# Altium schematic sheet MT-CHARHER  V1.0.0.SchDoc
size OrCAD D; SheetNumber: 0; SheetTotal: 0
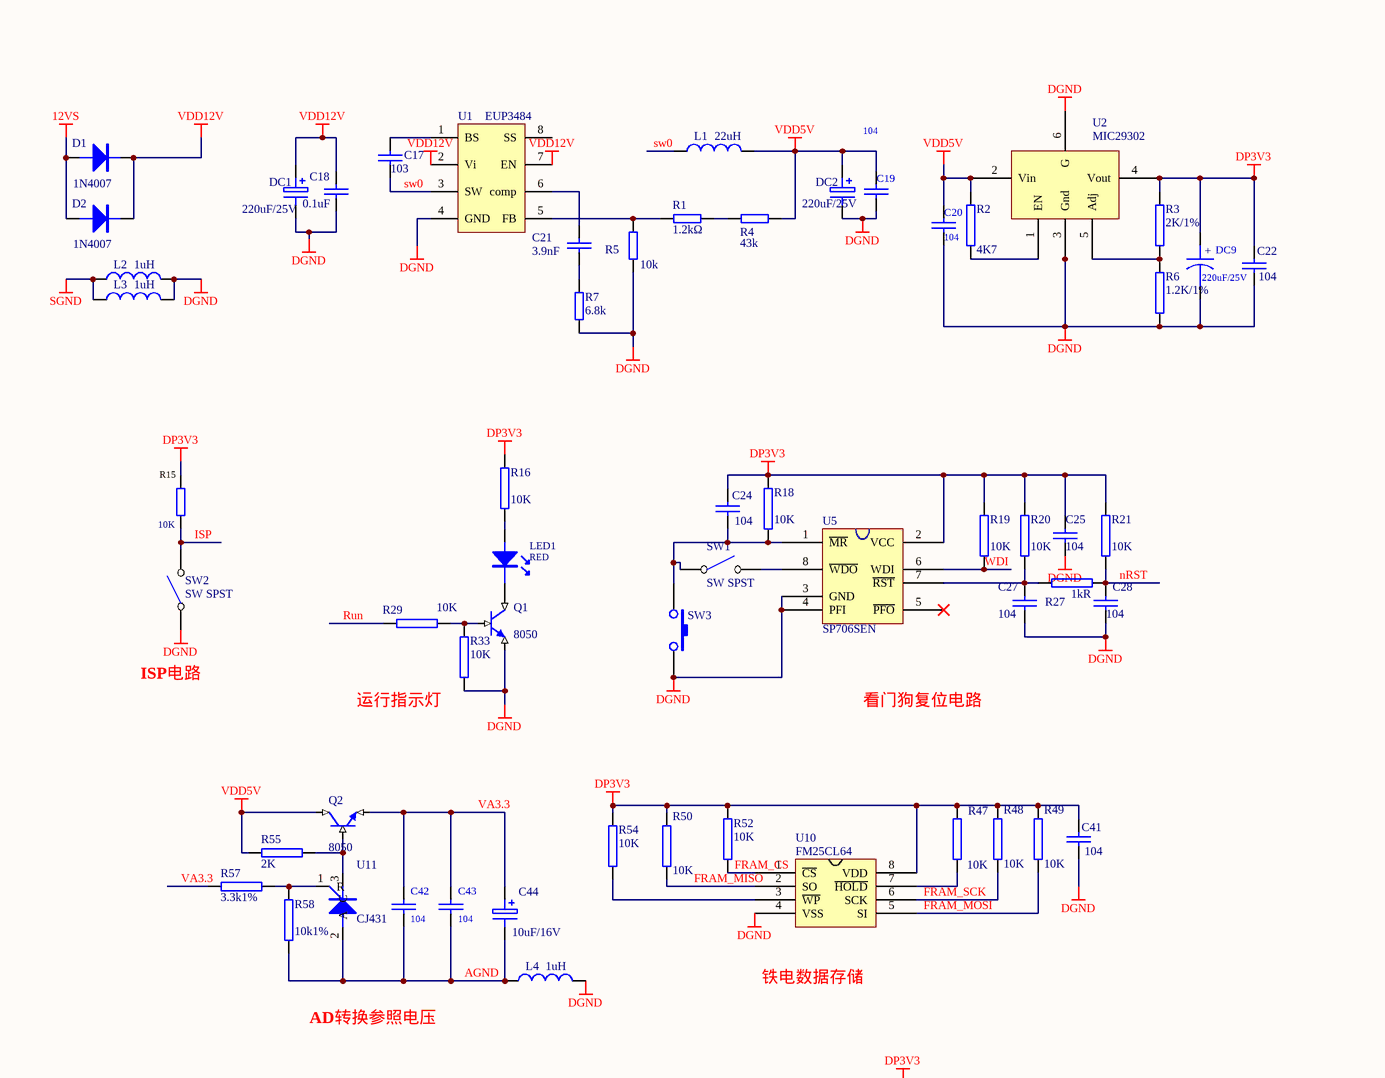
[diagram p0: MT-CHARHER  V1.0.0.SchDoc, top left]
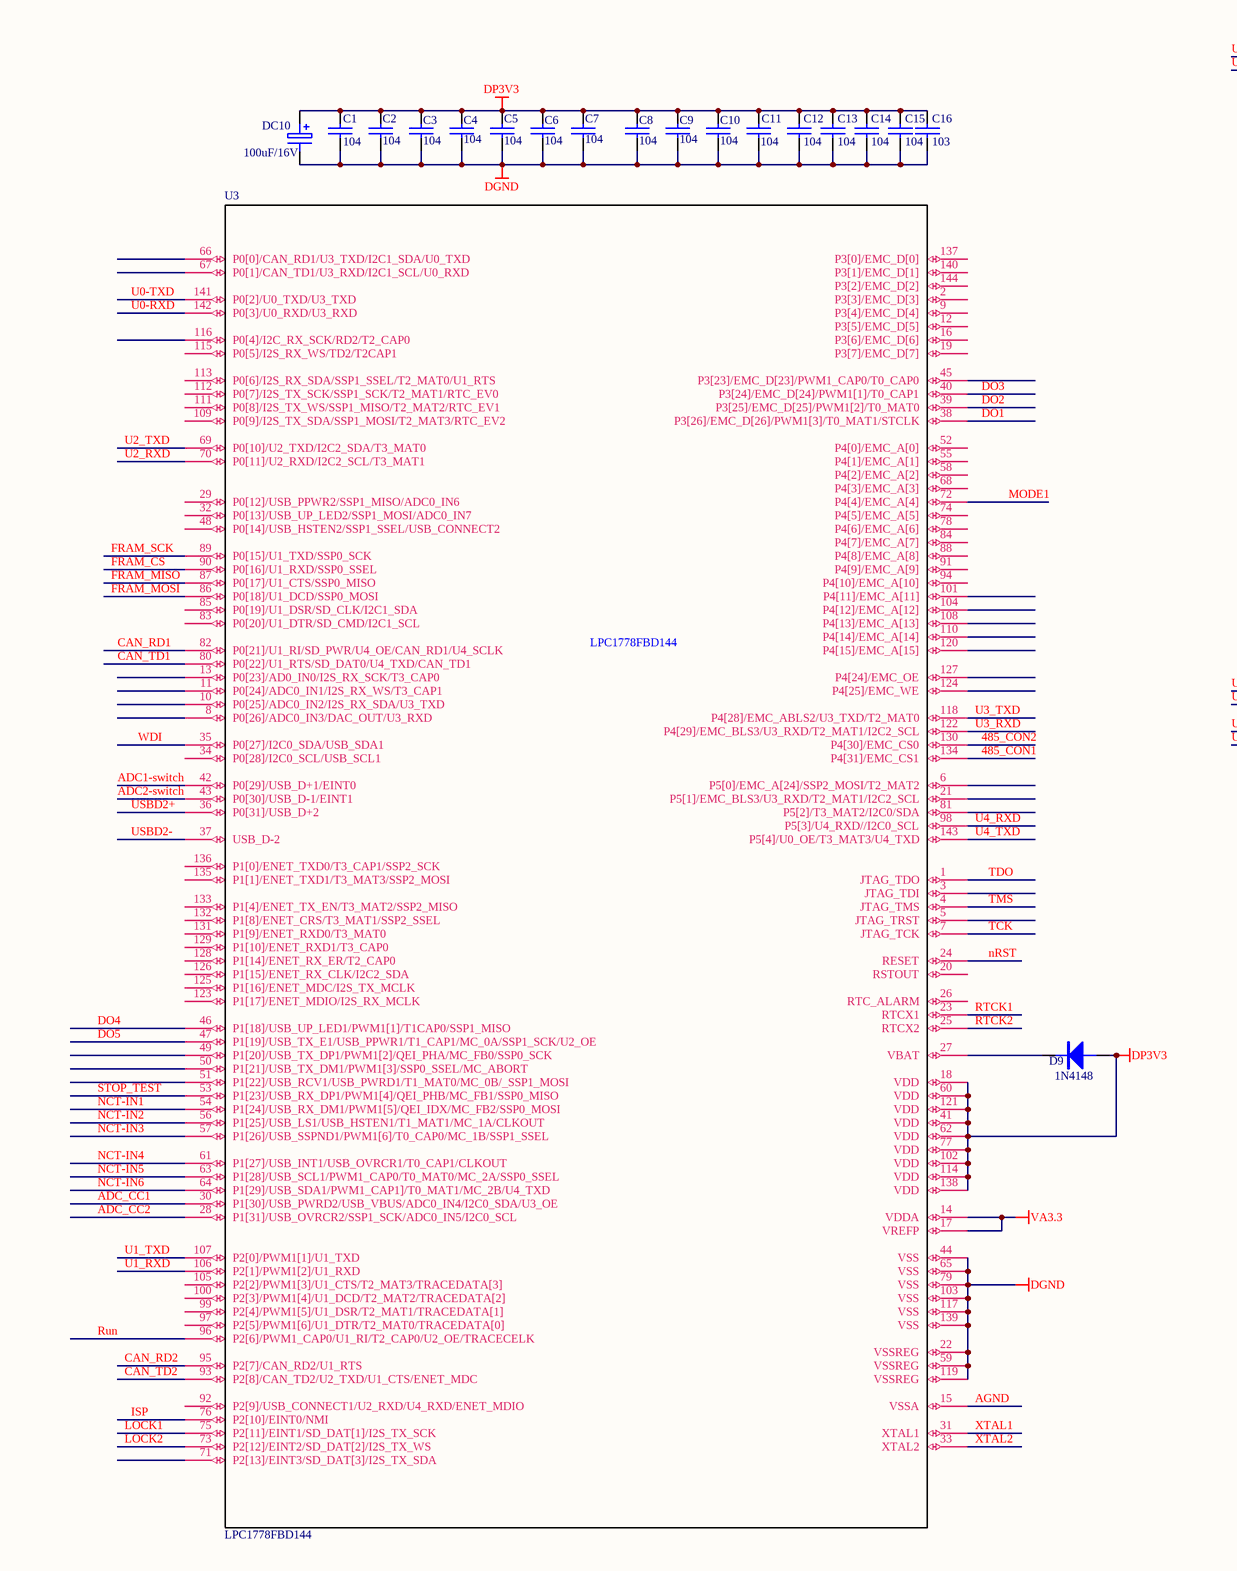
[diagram p1: MT-CHARHER  V1.0.0.SchDoc, top middle]
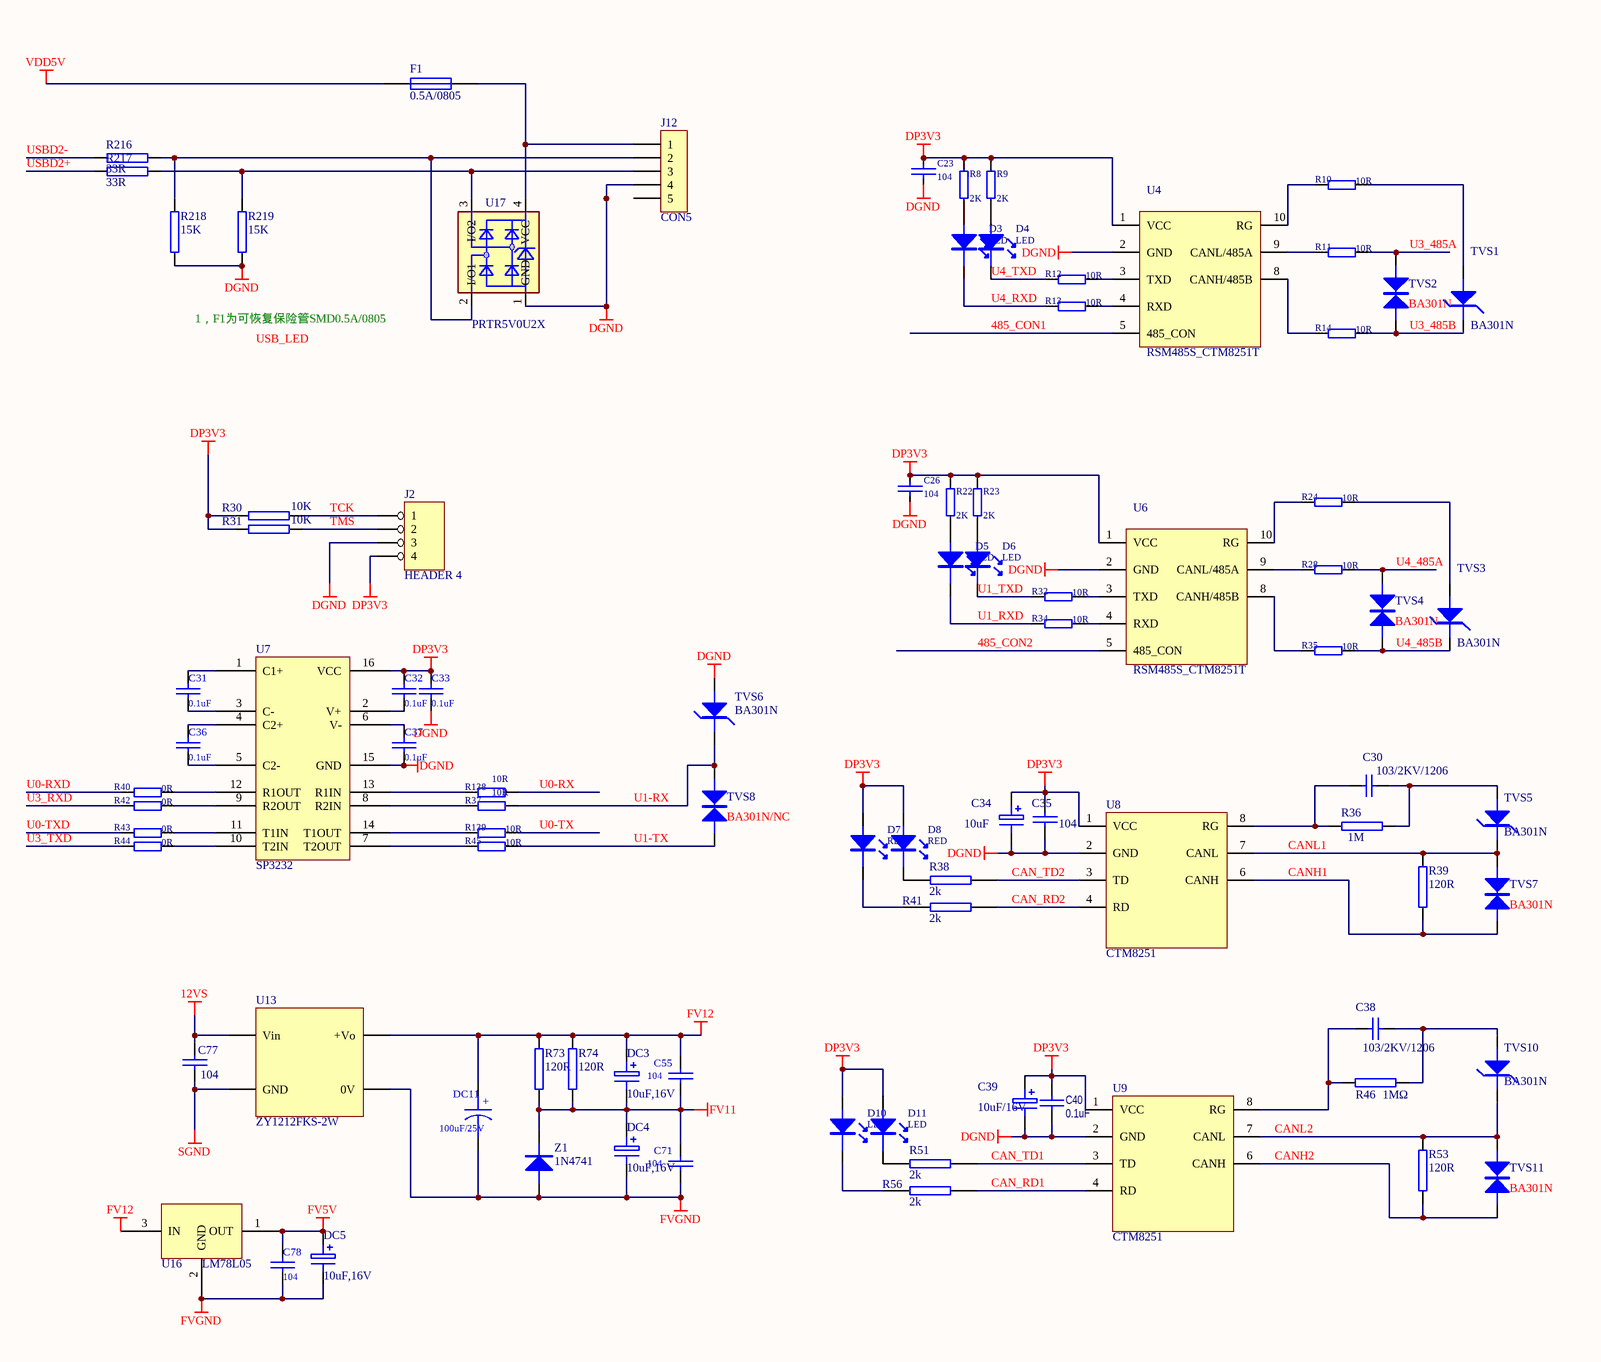
[diagram p2: MT-CHARHER  V1.0.0.SchDoc, top right]
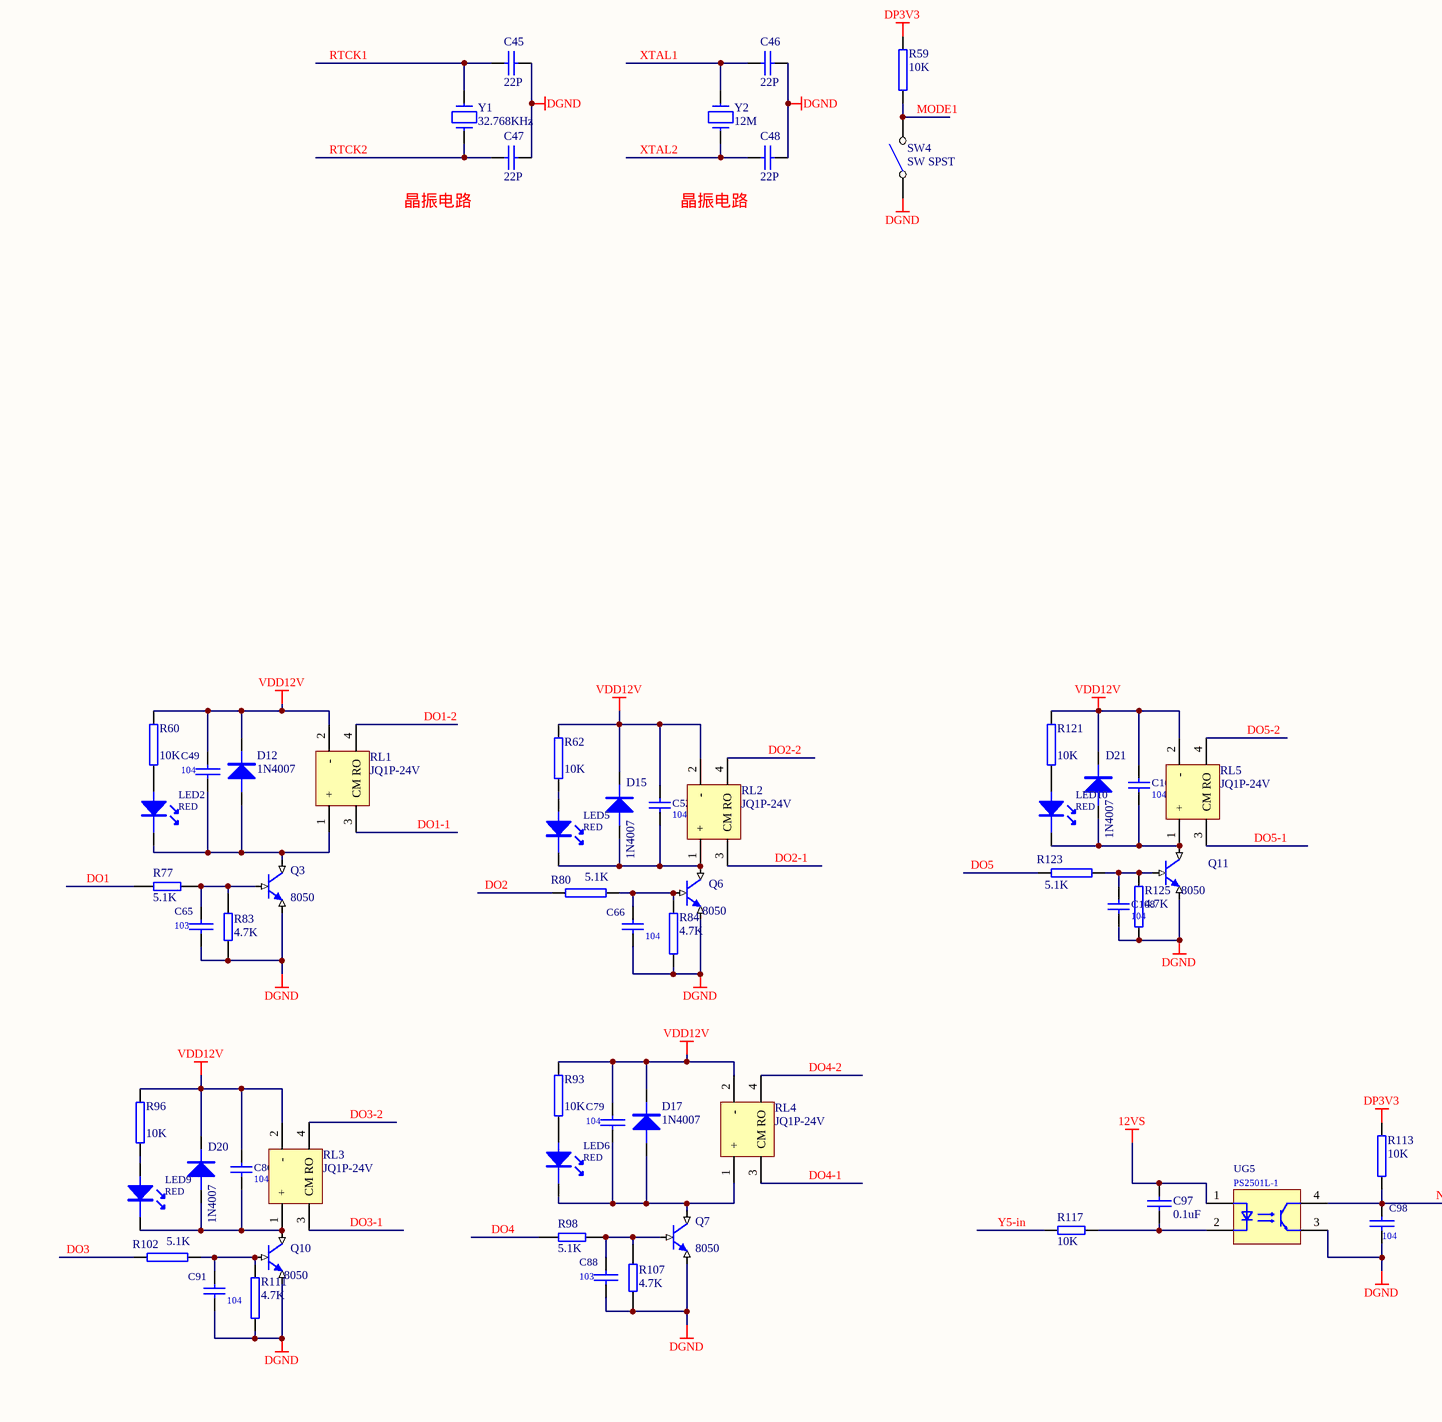
[diagram p3: MT-CHARHER  V1.0.0.SchDoc, bottom left]
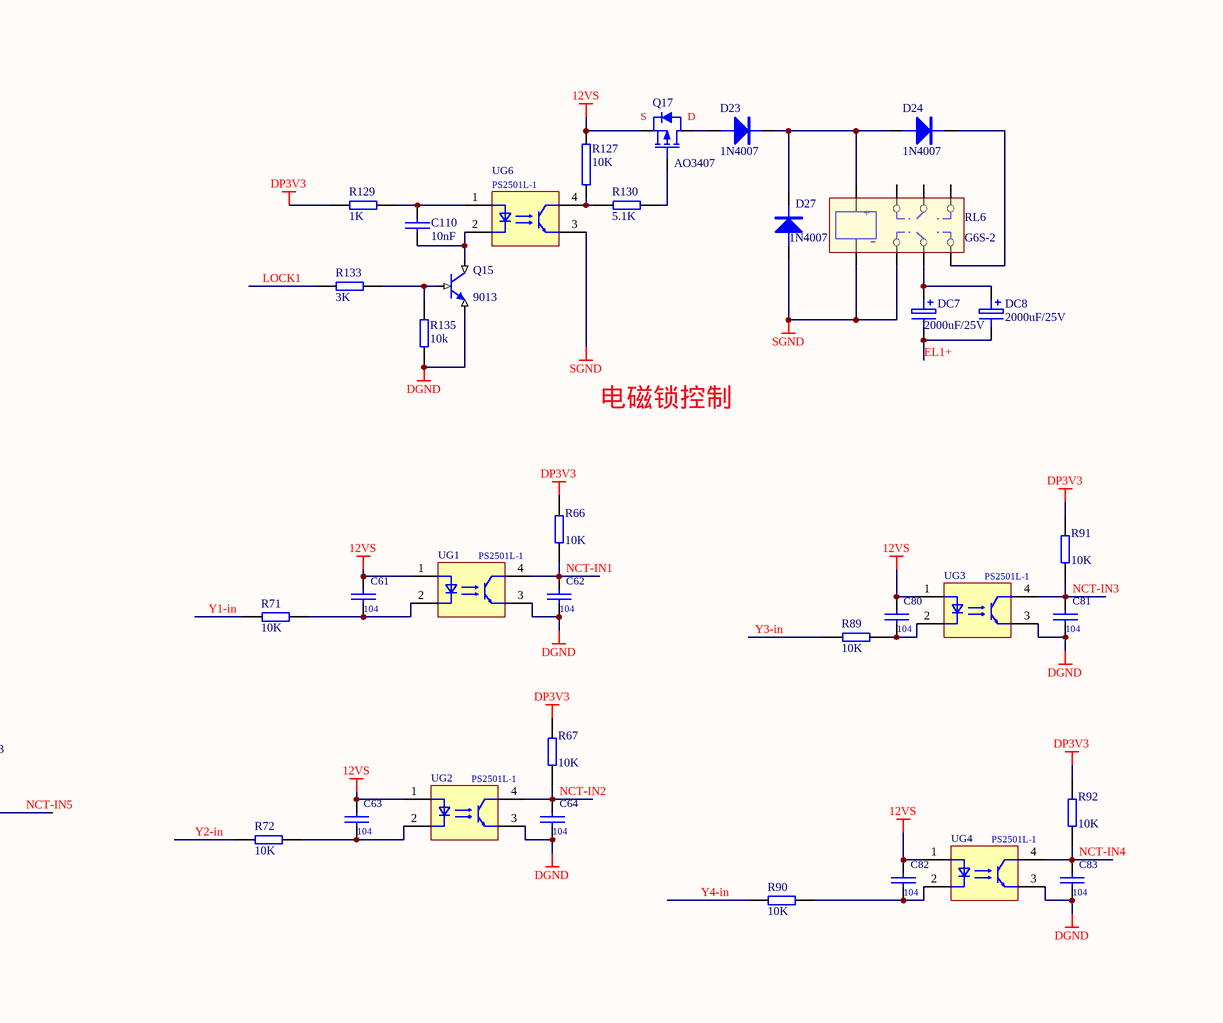
[diagram p4: MT-CHARHER  V1.0.0.SchDoc, bottom middle]
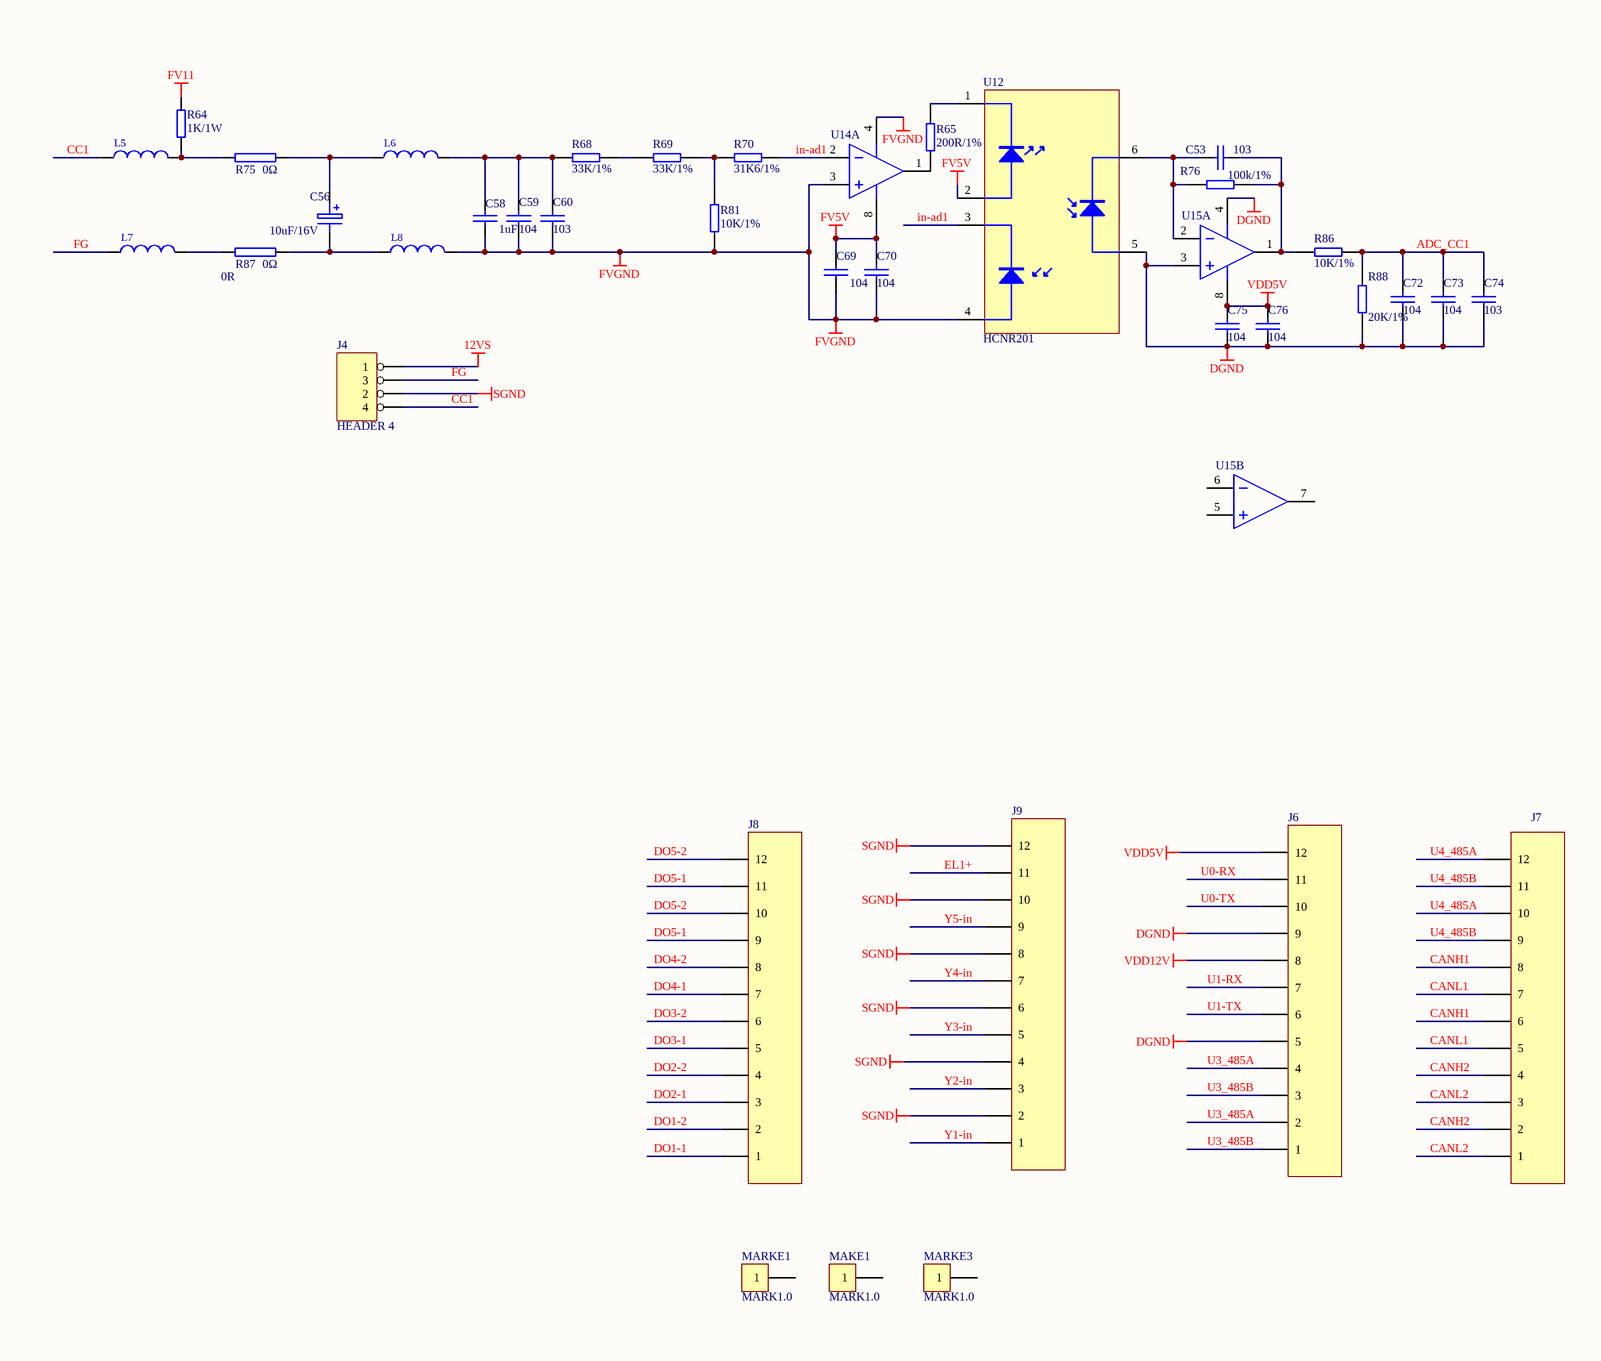
[diagram p5: MT-CHARHER  V1.0.0.SchDoc, bottom right]

## Parts
C1  104  [0603C]
C2  104  [0603C]
C3  104  [0603C]
C4  104  [0603C]
C5  104  [0603C]
C6  104  [0603C]
C7  104  [0603C]
C8  104  [0603C]
C9  104  [0603C]
C10  104  [0603C]
C11  104  [0603C]
C12  104  [0603C]
C13  104  [0603C]
C14  104  [0603C]
C15  104  [0603C]
C16  103  [0603C]
C17  103  [0603C]
C18  0.1uF  [0805C]
C19  104  [0603C]
C20  104  [0603C]
C21  3.9nF  [0603C]
C22  104  [0603C]
C23  104  [0603C]
C24  104  [0603C]
C25  104  [0603C]
C26  104  [0603C]
C27  104  [0603C]
C28  104  [0603C]
C30  103/2KV/1206  [1206C]
C31  0.1uF  [0603C]
C32  0.1uF  [0603C]
C33  0.1uF  [0603C]
C34  10uF  [CA1206]
C35  104  [0603C]
C36  0.1uF  [0603C]
C37  0.1uF  [0603C]
C38  103/2KV/1206  [1206C]
C39  10uF/16V  [CA1206]
C40  0.1uF  [0603C]
C41  104  [0603C]
C42  104  [0603C]
C43  104  [0603C]
C44  10uF/16V  [CA1206]
C45  22P  [0603C]
C46  22P  [0603C]
C47  22P  [0603C]
C48  22P  [0603C]
C49  104  [0603C]
C52  104  [0603C]
C53  103  [0603C]
C55  104  [0805C]
C56  10uF/16V  [CA1206]
C58  1uF  [0805C]
C59  104  [0603C]
C60  103  [0603C]
C61  104  [0603C]
C62  104  [0603C]
C63  104  [0603C]
C64  104  [0603C]
C65  103  [0603C]
C66  104  [0603C]
C69  104  [0603C]
C70  104  [0603C]
C71  104  [0805C]
C72  104  [0603C]
C73  104  [0603C]
C74  103  [0603C]
C75  104  [0603C]
C76  104  [0603C]
C77  104  [0805C]
C78  104  [0805C]
C79  104  [0603C]
C80  104  [0603C]
C81  104  [0603C]
C82  104  [0603C]
C83  104  [0603C]
C86  104  [0603C]
C88  103  [0603C]
C91  104  [0603C]
C97  0.1uF  [0603C]
C98  104  [0603C]
C106  104  [0603C]
C108  104  [0603C]
C110  10nF  [0603C]
D1  1N4007  [1206D]
D2  1N4007  [1206D]
D3  LED  [D0805]
D4  LED  [D0805]
D5  LED  [D0805]
D6  LED  [D0805]
D7  RED  [D0805]
D8  RED  [D0805]
D9  1N4148  [1206D]
D10  LED  [D0805]
D11  LED  [D0805]
D12  1N4007  [1206D]
D15  1N4007  [1206D]
D17  1N4007  [1206D]
D20  1N4007  [1206D]
D21  1N4007  [1206D]
D23  1N4007  [1206D]
D24  1N4007  [1206D]
D27  1N4007  [1206D]
DC1  220uF/25V  [C100UF16VEJ]
DC2  220uF/25V  [C100UF16VEJ]
DC3  10uF,16V  [CA1206]
DC4  10uF,16V  [CA1206]
DC5  10uF,16V  [CA1206]
DC7  2000uF/25V  [CAP12.5*20]
DC8  2000uF/25V  [CAP12.5*20]
DC9  220uF/25V  [C100UF16VEJ]
DC10  100uF/16V  [C100UF16VEJ]
DC11  100uF/25V  [C100UF16VEJ]
F1  0.5A/0805  [0805R]
J2  HEADER 4  [COM-2.54mm-90]
J4  HEADER 4  [KF2EDG-4P-3.81mm]
J6  J?  [KF2EDG-12P-3.81mm]  (value not drawn)
J7  J?  [KF2EDG-12P-3.81mm]  (value not drawn)
J8  J8  [KF2EDG-12P-3.81mm]  (value not drawn)
J9  J8  [KF2EDG-12P-3.81mm]  (value not drawn)
J12  CON5  [USB-A]
L1  22uH  [LC7*7*3_L]
L2  1uH  [1206R]
L3  1uH  [1206R]
L4  1uH  [1206R]
L5  1uH  [LC7*7*3_L]  (value not drawn)
L6  1uH  [1206R]  (value not drawn)
L7  1uH  [LC7*7*3_L]  (value not drawn)
L8  1uH  [1206R]  (value not drawn)
LED1  RED  [D0805]
LED2  RED  [D0805]
LED5  RED  [D0805]
LED6  RED  [D0805]
LED9  RED  [D0805]
LED10  RED  [D0805]
MAKE1  MARK1.0  [MARK1.0]
MARKE1  MARK1.0  [MARK1.0]
MARKE3  MARK1.0  [MARK1.0]
Q1  8050  [SOT23]
Q2  8050  [SOT23]
Q3  8050  [SOT23]
Q6  8050  [SOT23]
Q7  8050  [SOT23]
Q10  8050  [SOT23]
Q11  8050  [SOT23]
Q15  9013  [SOT23]
Q17  AO3407  [SOT-23L]
R1  1.2kΩ  [0603R]
R2  4K7  [0603R]
R3  2K/1%  [0603R]
R4  43k  [0603R]
R5  10k  [0603R]
R6  1.2K/1%  [0603R]
R7  6.8k  [0603R]
R8  2K  [0603R]
R9  2K  [0603R]
R10  10R  [0603R]
R11  10R  [0603R]
R12  10R  [0603R]
R13  10R  [0603R]
R14  10R  [0603R]
R15  10K  [0603R]
R16  10K  [0603R]
R18  10K  [0603R]
R19  10K  [0603R]
R20  10K  [0603R]
R21  10K  [0603R]
R22  2K  [0603R]
R23  2K  [0603R]
R24  10R  [0603R]
R27  1kR  [0603R]
R28  10R  [0603R]
R29  10K  [0603R]
R30  10K  [0603R]
R31  10K  [0603R]
R32  10R  [0603R]
R33  10K  [0603R]
R34  10R  [0603R]
R35  10R  [0603R]
R36  1M  [1206R]
R37  10R  [0603R]
R38  2k  [0603R]
R39  120R  [1206R]
R40  0R  [0603R]
R41  2k  [0603R]
R42  0R  [0603R]
R43  0R  [0603R]
R44  0R  [0603R]
R45  10R  [0603R]
R46  value 1MΩ  [1206R]  (hidden comment: 1M)
R47  10K  [0603R]
R48  10K  [0603R]
R49  10K  [0603R]
R50  10K  [0603R]
R51  2k  [0603R]
R52  10K  [0603R]
R53  120R  [1206R]
R54  10K  [0603R]
R55  2K  [0603R]
R56  2k  [0603R]
R57  3.3k1%  [0603R]
R58  10k1%  [0603R]
R59  10K  [0603R]
R60  10K  [0603R]
R62  10K  [0603R]
R64  1K/1W  [R1-1]
R65  200R/1%  [0603R]
R66  10K  [0603R]
R67  10K  [0603R]
R68  33K/1%  [0603R]
R69  33K/1%  [0603R]
R70  31K6/1%  [0603R]
R71  10K  [0603R]
R72  10K  [0603R]
R73  120R  [1206R]
R74  120R  [1206R]
R75  value 0Ω  [1206R]
R76  100k/1%  [0603R]
R77  5.1K  [0603R]
R80  5.1K  [0603R]
R81  10K/1%  [0603R]
R83  4.7K  [0603R]
R84  4.7K  [0603R]
R86  10K/1%  [0603R]
R87  0R  value 0Ω  [1206R]
R88  20K/1%  [0603R]
R89  10K  [0603R]
R90  10K  [0603R]
R91  10K  [0603R]
R92  10K  [0603R]
R93  10K  [0603R]
R96  10K  [0603R]
R98  5.1K  [0603R]
R102  5.1K  [0603R]
R107  4.7K  [0603R]
R111  4.7K  [0603R]
R113  10K  [0603R]
R117  10K  [0603R]
R121  10K  [0603R]
R123  5.1K  [0603R]
R125  4.7K  [0603R]
R127  10K  [0603R]
R129  1K  [0603R]
R130  5.1K  [0603R]
R133  3K  [0603R]
R135  10k  [0603R]
R138  10R  [0603R]
R139  10R  [0603R]
R216  33R  [0603R]
R217  33R  [0603R]
R218  15K  [0603R]
R219  15K  [0603R]
RL1  JQ1P-24V  [HF32F-12V]
RL2  JQ1P-24V  [HF32F-12V]
RL3  JQ1P-24V  [HF32F-12V]
RL4  JQ1P-24V  [HF32F-12V]
RL5  JQ1P-24V  [HF32F-12V]
RL6  G6S-2  [G6S-2]
SW1  SW SPST  [SW1]
SW2  SW SPST  [SW1]
SW3  按键  [SW]  (value not drawn)
SW4  SW SPST  [SW1]
TVS1  BA301N  [3528TVS]
TVS2  BA301N  [3528TVS]
TVS3  BA301N  [3528TVS]
TVS4  BA301N  [3528TVS]
TVS5  BA301N  [3528TVS]
TVS6  BA301N  [3528TVS]
TVS7  BA301N  [3528TVS]
TVS8  BA301N/NC  [3528TVS]
TVS10  BA301N  [3528TVS]
TVS11  BA301N  [3528TVS]
U1  EUP3484  [SOP8]
U2  MIC29302  [TO5B]
U3  LPC1778FBD144  [LC-LQFP-144_20x20x05P]
U4  RSM485S_CTM8251T  [RSM485]
U5  SP706SEN  [SOP8]
U6  RSM485S_CTM8251T  [RSM485]
U7  SP3232  [SO-16]
U8  CTM8251  [CTM8251KT]
U9  CTM8251  [CTM8251KT]
U10  FM25CL64  [SOP8]
U11  CJ431  [SOT23]
U12  HCNR201  [HCNR201-SMD]
U13  ZY1212FKS-2W  [ZY1212FKS-2W]
U14  LM358  [SOP8]  (value not drawn)  (part A of 2)
U15  LM358  [SOP8]  (value not drawn)  (parts A,B of 2)
U16  LM78L05  [SOT-89]
U17  PRTR5V0U2X  [SOT-143B]
UG1  PS2501L-1  [DIP-4]
UG2  PS2501L-1  [DIP-4]
UG3  PS2501L-1  [DIP-4]
UG4  PS2501L-1  [DIP-4]
UG5  PS2501L-1  [DIP-4]
UG6  PS2501L-1  [DIP-4]
Y1  32.768KHz  [ZS-32.768]
Y2  12M  [ZS_SMD]
Z1  1N4741  [1206D]

## Nets
12VS: C61.1 C63.1 C77.1 C80.1 C82.1 C97.2 D1.1(A) D2.1(A) J4.1 Q17.3(S) R127.2 U13.1(Vin) UG1.1 UG2.1 UG3.1 UG4.1 UG5.1
DGND: C1.2 C2.2 C3.2 C4.2 C5.2 C6.2 C7.2 C8.2 C9.2 C10.2 C11.2 C12.1 C13.2 C14.2 C15.2 C16.2 C18.1 C19.1 C20.1 C22.2 C23.2 C25.2 C26.2 C27.1 C28.1 C33.1 C34.2 C35.2 C37.1 C39.2 C40.1 C41.2 C45.2 C46.2 C47.2 C48.2 C62.2 C64.2 C65.2 C66.1 C72.1 C73.1 C74.1 C75.1 C76.1 C81.2 C83.2 C88.2 C91.1 C98.2 C108.1 DC1.2 DC2.2 DC9.2 DC10.2 J2.3 J6.5 J6.9 J12.4 L2.2 L3.2 L4.2 Q1.3(E) Q3.3(E) Q6.3(E) Q7.3(E) Q10.3(E) Q11.3(E) Q15.3(E) R5.2 R6.1 R7.2 R33.1 R83.1 R84.1 R88.2 R107.1 R111.1 R125.1 R135.1 R218.1 R219.1 SW2.1(COMMON) SW3.2 SW4.1(COMMON) TVS6.1 U1.4(GND) U2.3(Gnd) U2.6(G) U3.22(VSSREG) U3.44(VSS) U3.59(VSSREG) U3.65(VSS) U3.79(VSS) U3.103(VSS) U3.117(VSS) U3.119(VSSREG) U3.139(VSS) U4.2(GND) U5.3(GND) U5.4(PFI) U6.2(GND) U7.15(GND) U8.2(GND) U9.2(GND) U10.4(VSS) U12.5 U15.3(IN+) U15.4(GND) U17.1(GND) UG1.3 UG2.3 UG3.3 UG4.3 UG5.3
DP3V3: C1.1 C2.1 C3.1 C4.1 C5.1 C6.1 C7.1 C8.1 C9.1 C10.1 C11.1 C12.2 C13.1 C14.1 C15.1 C16.1 C22.1 C23.1 C24.1 C25.1 C26.1 C32.2 C33.2 C34.1 C35.1 C39.1 C40.2 C41.1 D7.1 D8.1 D9.1(A) D10.1 D11.1 DC9.1 DC10.1 J2.4 R3.2 R8.2 R9.2 R15.2 R16.2 R18.2 R19.1 R20.1 R21.1 R22.2 R23.2 R30.2 R31.2 R47.1 R48.1 R49.1 R50.1 R52.1 R54.1 R59.2 R66.1 R67.1 R91.1 R92.1 R113.1 R129.1 U2.4(Vout) U3.18(VDD) U3.41(VDD) U3.60(VDD) U3.62(VDD) U3.77(VDD) U3.102(VDD) U3.114(VDD) U3.121(VDD) U3.138(VDD) U4.1(VCC) U5.2(VCC) U6.1(VCC) U7.16(VCC) U8.1(VCC) U9.1(VCC) U10.8(VDD)
FV5V: C69.2 C70.1 C78.2 DC5.1 U12.2 U14.8(VCC) U16.1(OUT)
FV11: C55.1 C71.2 DC3.2 DC4.1 R64.2 R73.2 R74.2 Z1.2(K)
FV12: C55.2 DC3.1 DC11.1 R73.1 R74.1 U13.7(+Vo) U16.3(IN)
FVGND: C58.1 C59.2 C60.2 C69.1 C70.2 C71.1 C78.1 DC4.2 DC5.2 DC11.2 L8.2 R81.1 U12.4 U13.5(0V) U14.3(IN+) U14.4(GND) U16.2(GND) Z1.1(A)
SGND: C77.2 D27.1(A) J4.2 J9.2 J9.4 J9.6 J9.8 J9.10 J9.12 L2.1 L3.1 RL6.3 RL6.12 U13.2(GND) UG6.3
VA3.3: C42.1 C43.1 C44.1 Q2.3(E) R57.2 U3.14(VDDA) U3.17(VREFP)
VDD5V: C19.2 C20.2 C75.2 C76.2 DC2.1 F1.1 J6.12 L1.2 Q2.2(C) R2.1 R4.1 R55.2 U2.2(Vin) U15.8(VCC)
VDD12V: C18.2 C49.1 C52.2 C79.1 C86.2 C106.2 D1.2(K) D2.2(K) D12.2(K) D15.2(K) D17.2(K) D20.2(K) D21.2(K) DC1.1 J6.8 R60.2 R62.2 R93.2 R96.2 R121.2 RL1.2(-) RL2.2(-) RL3.2(-) RL4.2(-) RL5.2(-) U1.2(Vi) U1.7(EN)
485_CON1: U3.134(P4[31]/EMC_CS1) U4.5(485_CON)
485_CON2: U3.130(P4[30]/EMC_CS0) U6.5(485_CON)
ADC1-switch: U3.42(P0[29]/USB_D+1/EINT0)
ADC2-switch: U3.43(P0[30]/USB_D-1/EINT1)
ADC_CC1: C72.2 C73.2 C74.2 R86.2 R88.1 U3.30(P1[30]/USB_PWRD2/USB_VBUS/ADC0_IN4/I2C0_SDA/U3_OE)
ADC_CC2: U3.28(P1[31]/USB_OVRCR2/SSP1_SCK/ADC0_IN5/I2C0_SCL)
AGND: C42.2 C43.2 C44.2 L4.1 R58.1 U3.15(VSSA) U11.2(A)
CAN_RD1: R56.2 U3.82(P0[21]/U1_RI/SD_PWR/U4_OE/CAN_RD1/U4_SCLK) U9.4(RD)
CAN_RD2: R41.2 U3.95(P2[7]/CAN_RD2/U1_RTS) U8.4(RD)
CAN_TD1: R51.2 U3.80(P0[22]/U1_RTS/SD_DAT0/U4_TXD/CAN_TD1) U9.3(TD)
CAN_TD2: R38.2 U3.93(P2[8]/CAN_TD2/U2_TXD/U1_CTS/ENET_MDC) U8.3(TD)
CANH1: J7.6 J7.8 R39.2 TVS7.1 U8.6(CANH)
CANH2: J7.2 J7.4 R53.2 TVS11.1 U9.6(CANH)
CANL1: J7.5 J7.7 R39.1 TVS5.2 TVS7.2 U8.7(CANL)
CANL2: J7.1 J7.3 R53.1 TVS10.2 TVS11.2 U9.7(CANL)
CC1: J4.4 L5.1
DO1: R77.1 U3.38(P3[26]/EMC_D[26]/PWM1[3]/T0_MAT1/STCLK)
DO1-1: J8.1 RL1.3(CM)
DO1-2: J8.2 RL1.4(RO)
DO2: R80.1 U3.39(P3[25]/EMC_D[25]/PWM1[2]/T0_MAT0)
DO2-1: J8.3 RL2.3(CM)
DO2-2: J8.4 RL2.4(RO)
DO3: R102.1 U3.40(P3[24]/EMC_D[24]/PWM1[1]/T0_CAP1)
DO3-1: J8.5 RL3.3(CM)
DO3-2: J8.6 RL3.4(RO)
DO4: R98.1 U3.46(P1[18]/USB_UP_LED1/PWM1[1]/T1CAP0/SSP1_MISO)
DO4-1: J8.7 RL4.3(CM)
DO4-2: J8.8 RL4.4(RO)
DO5: R123.1 U3.47(P1[19]/USB_TX_E1/USB_PPWR1/T1_CAP1/MC_0A/SSP1_SCK/U2_OE)
DO5-1: J8.9 J8.11 RL5.3(CM)
DO5-2: J8.10 J8.12 RL5.4(RO)
EL1+: DC7.2 DC8.2 J9.11
FG: J4.3 L7.1
FRAM_CS: R52.2 U3.90(P0[16]/U1_RXD/SSP0_SSEL) U10.1(~{CS})
FRAM_MISO: R50.2 U3.87(P0[17]/U1_CTS/SSP0_MISO) U10.2(SO)
FRAM_MOSI: R49.2 U3.86(P0[18]/U1_DCD/SSP0_MOSI) U10.5(SI)
FRAM_SCK: R48.2 U3.89(P0[15]/U1_TXD/SSP0_SCK) U10.6(SCK)
in-ad1: R70.2 U12.3 U14.2(IN-)
ISP: R15.1 SW2.2(NO) U3.76(P2[10]/EINT0/NMI)
LOCK1: R133.1 U3.75(P2[11]/EINT1/SD_DAT[1]/I2S_TX_SCK)
LOCK2: U3.73(P2[12]/EINT2/SD_DAT[2]/I2S_TX_WS)
MODE1: R59.1 SW4.2(NO) U3.72(P4[4]/EMC_A[4])
NCT-IN1: C62.1 R66.2 U3.54(P1[24]/USB_RX_DM1/PWM1[5]/QEI_IDX/MC_FB2/SSP0_MOSI) UG1.4
NCT-IN2: C64.1 R67.2 U3.56(P1[25]/USB_LS1/USB_HSTEN1/T1_MAT1/MC_1A/CLKOUT) UG2.4
NCT-IN3: C81.1 R91.2 U3.57(P1[26]/USB_SSPND1/PWM1[6]/T0_CAP0/MC_1B/SSP1_SSEL) UG3.4
NCT-IN4: C83.1 R92.2 U3.61(P1[27]/USB_INT1/USB_OVRCR1/T0_CAP1/CLKOUT) UG4.4
NCT-IN5: C98.1 R113.2 U3.63(P1[28]/USB_SCL1/PWM1_CAP0/T0_MAT0/MC_2A/SSP0_SSEL) UG5.4
NCT-IN6: U3.64(P1[29]/USB_SDA1/PWM1_CAP1]/T0_MAT1/MC_2B/U4_TXD)
nRST: C28.2 R21.2 R27.2 U3.24(RESET)
RTCK1: C45.1 U3.23(RTCX1) Y1.1
RTCK2: C47.1 U3.25(RTCX2) Y1.2
Run: R29.1 U3.96(P2[6]/PWM1_CAP0/U1_RI/T2_CAP0/U2_OE/TRACECELK)
STOP_TEST: U3.53(P1[23]/USB_RX_DP1/PWM1[4]/QEI_PHB/MC_FB1/SSP0_MISO)
sw0: C17.1 L1.1 U1.3(SW)
TCK: J2.1 R30.1 U3.7(JTAG_TCK)
TDO: U3.1(JTAG_TDO)
TMS: J2.2 R31.1 U3.4(JTAG_TMS)
U0-RX: J6.11 R138.2
U0-RXD: R40.1 U3.142(P0[3]/U0_RXD/U3_RXD)
U0-TX: J6.10 R139.2
U0-TXD: R43.1 U3.141(P0[2]/U0_TXD/U3_TXD)
U1-RX: J6.7 R37.2 TVS6.2 TVS8.2
U1-TX: J6.6 R45.2 TVS8.1
U1_RXD: D5.2 R34.1 U3.106(P2[1]/PWM1[2]/U1_RXD)
U1_TXD: D6.2 R32.1 U3.107(P2[0]/PWM1[1]/U1_TXD)
U2_RXD: U3.70(P0[11]/U2_RXD/I2C2_SCL/T3_MAT1)
U2_TXD: U3.69(P0[10]/U2_TXD/I2C2_SDA/T3_MAT0)
U3_485A: J6.2 J6.4 R11.2 TVS2.2
U3_485B: J6.1 J6.3 R14.2 TVS1.2 TVS2.1
U3_RXD: R42.1 U3.122(P4[29]/EMC_BLS3/U3_RXD/T2_MAT1/I2C2_SCL)
U3_TXD: R44.1 U3.118(P4[28]/EMC_ABLS2/U3_TXD/T2_MAT0)
U4_485A: J7.10 J7.12 R28.2 TVS4.2
U4_485B: J7.9 J7.11 R35.2 TVS3.2 TVS4.1
U4_RXD: D3.2 R13.1 U3.98(P5[3]/U4_RXD//I2C0_SCL)
U4_TXD: D4.2 R12.1 U3.143(P5[4]/U0_OE/T3_MAT3/U4_TXD)
USBD2+: R217.2 U3.36(P0[31]/USB_D+2)
USBD2-: R216.2 U3.37(USB_D-2)
WDI: R19.2 U3.35(P0[27]/I2C0_SDA/USB_SDA1) U5.6(WDI)
XTAL1: C46.1 U3.31(XTAL1) Y2.2
XTAL2: C48.1 U3.33(XTAL2) Y2.1
Y1-in: J9.1 R71.1
Y2-in: J9.3 R72.1
Y3-in: J9.5 R89.1
Y4-in: J9.7 R90.1
Y5-in: J9.9 R117.1
NetC17_2: C17.2 U1.1(BS)
NetC21_1: C21.1 U1.6(comp)
NetC21_2: C21.2 R7.1
NetC24_2: C24.2 R18.1 SW1.1(COMMON) SW3.1 U5.1(~{MR})
NetC27_2: C27.2 R20.2 R27.1 U5.7(~{RST})
NetC30_1: C30.1 R36.1 TVS5.1
NetC30_2: C30.2 R36.2 U8.8(RG)
NetC31_1: C31.1 U7.3(C-)
NetC31_2: C31.2 U7.1(C1+)
NetC32_1: C32.1 U7.2(V+)
NetC36_1: C36.1 U7.5(C2-)
NetC36_2: C36.2 U7.4(C2+)
NetC37_2: C37.2 U7.6(V-)
NetC38_1: C38.1 R46.1 U9.8(RG)
NetC38_2: C38.2 R46.2 TVS10.1
NetC49_2: C49.2 D12.1(A) LED2.2 Q3.2(C) RL1.1(+)
NetC52_1: C52.1 D15.1(A) LED5.2 Q6.2(C) RL2.1(+)
NetC53_1: C53.1 R76.1 R86.1 U15.1(OUT)
NetC53_2: C53.2 R76.2 U12.6 U15.2(IN-)
NetC56_1: C56.1 L6.1 R75.2
NetC56_2: C56.2 L8.1 R87.2
NetC58_2: C58.2 C59.1 C60.1 L6.2 R68.1
NetC61_2: C61.2 R71.2 UG1.2
NetC63_2: C63.2 R72.2 UG2.2
NetC65_1: C65.1 Q3.1(B) R77.2 R83.2
NetC66_2: C66.2 Q6.1(B) R80.2 R84.2
NetC79_2: C79.2 D17.1(A) LED6.2 Q7.2(C) RL4.1(+)
NetC80_2: C80.2 R89.2 UG3.2
NetC82_2: C82.2 R90.2 UG4.2
NetC86_1: C86.1 D20.1(A) LED9.2 Q10.2(C) RL3.1(+)
NetC88_1: C88.1 Q7.1(B) R98.2 R107.2
NetC91_2: C91.2 Q10.1(B) R102.2 R111.2
NetC97_1: C97.1 R117.2 UG5.2
NetC106_1: C106.1 D21.1(A) LED10.2 Q11.2(C) RL5.1(+)
NetC108_2: C108.2 Q11.1(B) R123.2 R125.2
NetC110_1: C110.1 Q15.2(C) UG6.2
NetC110_2: C110.2 R129.2 UG6.1
NetD3_1: D3.1 R8.1
NetD4_1: D4.1 R9.1
NetD5_1: D5.1 R22.1
NetD6_1: D6.1 R23.1
NetD7_2: D7.2 R41.1
NetD8_2: D8.2 R38.1
NetD9_2: D9.2(K) U3.27(VBAT)
NetD10_2: D10.2 R56.1
NetD11_2: D11.2 R51.1
NetD23_1: D23.1(A) Q17.2(D)
NetD23_2: D23.2(K) D24.1(A) D27.2(K) RL6.1
NetD24_2: D24.2(K) RL6.5
NetDC7_1: DC7.1 DC8.1 RL6.4
NetF1_2: F1.2 J12.1 U17.4(VCC)
NetJ12_2: J12.2 R216.1 R218.2 U17.2(I/O1)
NetJ12_3: J12.3 R217.1 R219.2 U17.3(I/O2)
NetL5_2: L5.2 R64.1 R75.1
NetL7_2: L7.2 R87.1
NetLED1_1: LED1.1 R16.1
NetLED1_2: LED1.2 Q1.2(C)
NetLED2_1: LED2.1 R60.1
NetLED5_1: LED5.1 R62.1
NetLED6_1: LED6.1 R93.1
NetLED9_1: LED9.1 R96.1
NetLED10_1: LED10.1 R121.1
NetQ1_1: Q1.1(B) R29.2 R33.2
NetQ2_1: Q2.1(B) R55.1 U11.3(C)
NetQ15_1: Q15.1(B) R133.2 R135.2
NetQ17_1: Q17.1(G) R130.2
NetR1_1: R1.1 R4.2
NetR1_2: R1.2 R5.1 U1.5(FB)
NetR2_2: R2.2 U2.1(EN)
NetR3_1: R3.1 R6.2 U2.5(Adj)
NetR10_1: R10.1 U4.10(RG)
NetR10_2: R10.2 TVS1.1
NetR11_1: R11.1 U4.9(CANL/485A)
NetR12_2: R12.2 U4.3(TXD)
NetR13_2: R13.2 U4.4(RXD)
NetR14_1: R14.1 U4.8(CANH/485B)
NetR24_1: R24.1 U6.10(RG)
NetR24_2: R24.2 TVS3.1
NetR28_1: R28.1 U6.9(CANL/485A)
NetR32_2: R32.2 U6.3(TXD)
NetR34_2: R34.2 U6.4(RXD)
NetR35_1: R35.1 U6.8(CANH/485B)
NetR37_1: R37.1 U7.8(R2IN)
NetR40_2: R40.2 U7.12(R1OUT)
NetR42_2: R42.2 U7.9(R2OUT)
NetR43_2: R43.2 U7.11(T1IN)
NetR44_2: R44.2 U7.10(T2IN)
NetR45_1: R45.1 U7.7(T2OUT)
NetR47_2: R47.2 U10.7(~{HOLD})
NetR54_2: R54.2 U10.3(~{WP})
NetR57_1: R57.1 R58.2 U11.1(R)
NetR65_1: R65.1 U14.1(OUT)
NetR65_2: R65.2 U12.1
NetR68_2: R68.2 R69.1
NetR69_2: R69.2 R70.1 R81.2
NetR127_1: R127.1 R130.1 UG6.4
NetR138_1: R138.1 U7.13(R1IN)
NetR139_1: R139.1 U7.14(T1OUT)
NetSW1_2: SW1.2(NO) U5.8(~{WDO})

Not connected (* = marked no-connect by the designer): J12 5; MAKE1 1; MARKE1 1; MARKE3 1; RL6 8 9 10; U1 8(SS); U3 2(P3[3]/EMC_D[3]) 3(JTAG_TDI) 5(JTAG_TRST) 6(P5[0]/EMC_A[24]/SSP2_MOSI/T2_MAT2) 8(P0[26]/ADC0_IN3/DAC_OUT/U3_RXD) 9(P3[4]/EMC_D[4]) 10(P0[25]/ADC0_IN2/I2S_RX_SDA/U3_TXD) 11(P0[24]/ADC0_IN1/I2S_RX_WS/T3_CAP1) 12(P3[5]/EMC_D[5]) 13(P0[23]/AD0_IN0/I2S_RX_SCK/T3_CAP0) 16(P3[6]/EMC_D[6]) 19(P3[7]/EMC_D[7]) 20(RSTOUT) 21(P5[1]/EMC_BLS3/U3_RXD/T2_MAT1/I2C2_SCL) 26(RTC_ALARM) 29(P0[12]/USB_PPWR2/SSP1_MISO/ADC0_IN6) 32(P0[13]/USB_UP_LED2/SSP1_MOSI/ADC0_IN7) 34(P0[28]/I2C0_SCL/USB_SCL1) 45(P3[23]/EMC_D[23]/PWM1_CAP0/T0_CAP0) 48(P0[14]/USB_HSTEN2/SSP1_SSEL/USB_CONNECT2) 49(P1[20]/USB_TX_DP1/PWM1[2]/QEI_PHA/MC_FB0/SSP0_SCK) 50(P1[21]/USB_TX_DM1/PWM1[3]/SSP0_SSEL/MC_ABORT) 51(P1[22]/USB_RCV1/USB_PWRD1/T1_MAT0/MC_0B/_SSP1_MOSI) 52(P4[0]/EMC_A[0]) 55(P4[1]/EMC_A[1]) 58(P4[2]/EMC_A[2]) 66(P0[0]/CAN_RD1/U3_TXD/I2C1_SDA/U0_TXD) 67(P0[1]/CAN_TD1/U3_RXD/I2C1_SCL/U0_RXD) 68(P4[3]/EMC_A[3]) 71(P2[13]/EINT3/SD_DAT[3]/I2S_TX_SDA) 74(P4[5]/EMC_A[5]) 78(P4[6]/EMC_A[6]) 81(P5[2]/T3_MAT2/I2C0/SDA) 83(P0[20]/U1_DTR/SD_CMD/I2C1_SCL) 84(P4[7]/EMC_A[7]) 85(P0[19]/U1_DSR/SD_CLK/I2C1_SDA) 88(P4[8]/EMC_A[8]) 91(P4[9]/EMC_A[9]) 92(P2[9]/USB_CONNECT1/U2_RXD/U4_RXD/ENET_MDIO) 94(P4[10]/EMC_A[10]) 97(P2[5]/PWM1[6]/U1_DTR/T2_MAT0/TRACEDATA[0]) 99(P2[4]/PWM1[5]/U1_DSR/T2_MAT1/TRACEDATA[1]) 100(P2[3]/PWM1[4]/U1_DCD/T2_MAT2/TRACEDATA[2]) 101(P4[11]/EMC_A[11]) 104(P4[12]/EMC_A[12]) 105(P2[2]/PWM1[3]/U1_CTS/T2_MAT3/TRACEDATA[3]) 108(P4[13]/EMC_A[13]) 109(P0[9]/I2S_TX_SDA/SSP1_MOSI/T2_MAT3/RTC_EV2) 110(P4[14]/EMC_A[14]) 111(P0[8]/I2S_TX_WS/SSP1_MISO/T2_MAT2/RTC_EV1) 112(P0[7]/I2S_TX_SCK/SSP1_SCK/T2_MAT1/RTC_EV0) 113(P0[6]/I2S_RX_SDA/SSP1_SSEL/T2_MAT0/U1_RTS) 115(P0[5]/I2S_RX_WS/TD2/T2CAP1) 116(P0[4]/I2C_RX_SCK/RD2/T2_CAP0) 120(P4[15]/EMC_A[15]) 123(P1[17]/ENET_MDIO/I2S_RX_MCLK) 124(P4[25]/EMC_WE) 125(P1[16]/ENET_MDC/I2S_TX_MCLK) 126(P1[15]/ENET_RX_CLK/I2C2_SDA) 127(P4[24]/EMC_OE) 128(P1[14]/ENET_RX_ER/T2_CAP0) 129(P1[10]/ENET_RXD1/T3_CAP0) 131(P1[9]/ENET_RXD0/T3_MAT0) 132(P1[8]/ENET_CRS/T3_MAT1/SSP2_SSEL) 133(P1[4]/ENET_TX_EN/T3_MAT2/SSP2_MISO) 135(P1[1]/ENET_TXD1/T3_MAT3/SSP2_MOSI) 136(P1[0]/ENET_TXD0/T3_CAP1/SSP2_SCK) 137(P3[0]/EMC_D[0]) 140(P3[1]/EMC_D[1]) 144(P3[2]/EMC_D[2]); U5 5(~{PFO})*; U15 5(IN+) 6(IN-) 7(OUT)

## Notes on the sheet
- 1，F1为可恢复保险管SMD0.5A/0805
- ISP电路
- 运行指示灯
- 看门狗复位电路
- 铁电数据存储
- AD转换参照电压
- 晶振电路
- (near Q17) S
- (near Q17) D
- 电磁锁控制
- Labels drawn without touching a wire or pin: USB_LED
- (in symbol CAPACITOR POL) +
- (in symbol G6S-2) +; -

## Library data of the parts
C1-C16 C41 C45-C48 C77 = CAP1
C17 C18 C21 = CAP
C19 C20 C31-C33 C35-C37 C40 C42 C43 C49 C55 C58 C61-C65 C71 C78-C83 C88 C97 C98 C110 = CAP: Capacitor
C22 C24 C25 C27 C28 = CAP1: CAP
C23 C26 = CAP_1
C30 C38 = 0.1uF: C0603; Published: *; LatestRevisionDate: *; LatestRevisionNote: *; Publisher: *; Value: *
C34 C39 C44 C56 DC1-DC5 DC7 DC8 DC10 = CAP2
C52 C66 C86 C91 C106 C108 = Cap: Capacitor; Published: *; LatestRevisionDate: *; LatestRevisionNote: *; PackageReference: *; Publisher: *; Value: *
C53 C59 C60 C69 C70 C72-C76 = CAP1: Capacitor
D1 D2 D9 D12 D15 D17 D20 D21 D23 D24 D27 Z1 = DIODE
D7 D8 LED1 LED2 LED5 LED6 LED9 LED10 = LED
DC9 DC11 = CAPACITOR POL: Capacitor
F1 = FUSE1: Fuse
J2 J4 = 4 HEADER: 4 Pin Header
J6-J9 = CON12
J12 = CON5: Connector
L1-L8 = INDUCTOR
MAKE1 MARKE1 MARKE3 = CON1: Connector
Q1-Q3 Q6 Q7 Q10 Q11 Q15 = NPN
Q17 = PMOS
R1 R4 R5 R7 R64 = R_S
R2 R3 R6 R16 R18-R21 R27 R29-R31 R33 R47-R50 R52 R54 R55 R57-R60 R62 R65-R72 R76 R77 R80 R81 R83 R84 R86 R88-R93 R96 R98 R102 R107 R111 R113 R121 R123 R125 R127 R129 R130 R133 R135 = RES1
R8-R15 R22-R24 R28 R32 R34 R35 R37 R40 R42-R45 R117 R138 R139 = RES-1: RES
R36 R38 R39 R41 R51 R53 R56 R73 R74 R216-R219 = RES2
  R36: 物料: *; Value: 1M; 规: *; RoHS: *; 贴片: *; ComponentLink1Description: *; ComponentLink1URL: *; 现有: *
  R39 R53 R73 R74: 物料: *; Value: 120R; 规: *; RoHS: *; 贴片: *; ComponentLink1Description: *; ComponentLink1URL: *; 现有: *
R46 R75 R87 = RES2: 物料: 1.01.03.0019; 规: 1MΩ,1206,RoHS; 贴片: SMT; 现有: 16230; RoHS: RoHS; ComponentLink1Description: ErpDataInfo; ComponentLink1URL: http://192.168.0.2:8012/ErpExt/ErpData/ListMateriel.aspx?pkey=1.01.03.0019
RL1-RL5 = JQ1P-12V
SW3 = SW-PB
TVS1 TVS3 TVS5 TVS6 TVS10 = TVS-D
TVS2 TVS4 TVS7 TVS8 TVS11 = TVS
U3 = LPC1778LQFP144
U7 = MAX232ESE
U11 = TL431: TL431,SOT23/ST/ON
U12 = HCNR200
U14 U15 = AS358P-E1
U16 = LM7805
U17 = PRTR5V0U2X_1
UG1-UG6 = PS2501-1
Y1 Y2 = CRYSTAL